# EasyEDA Pro project ProProject_校电赛c题第二版_2024-10-13.epro, board PCB3
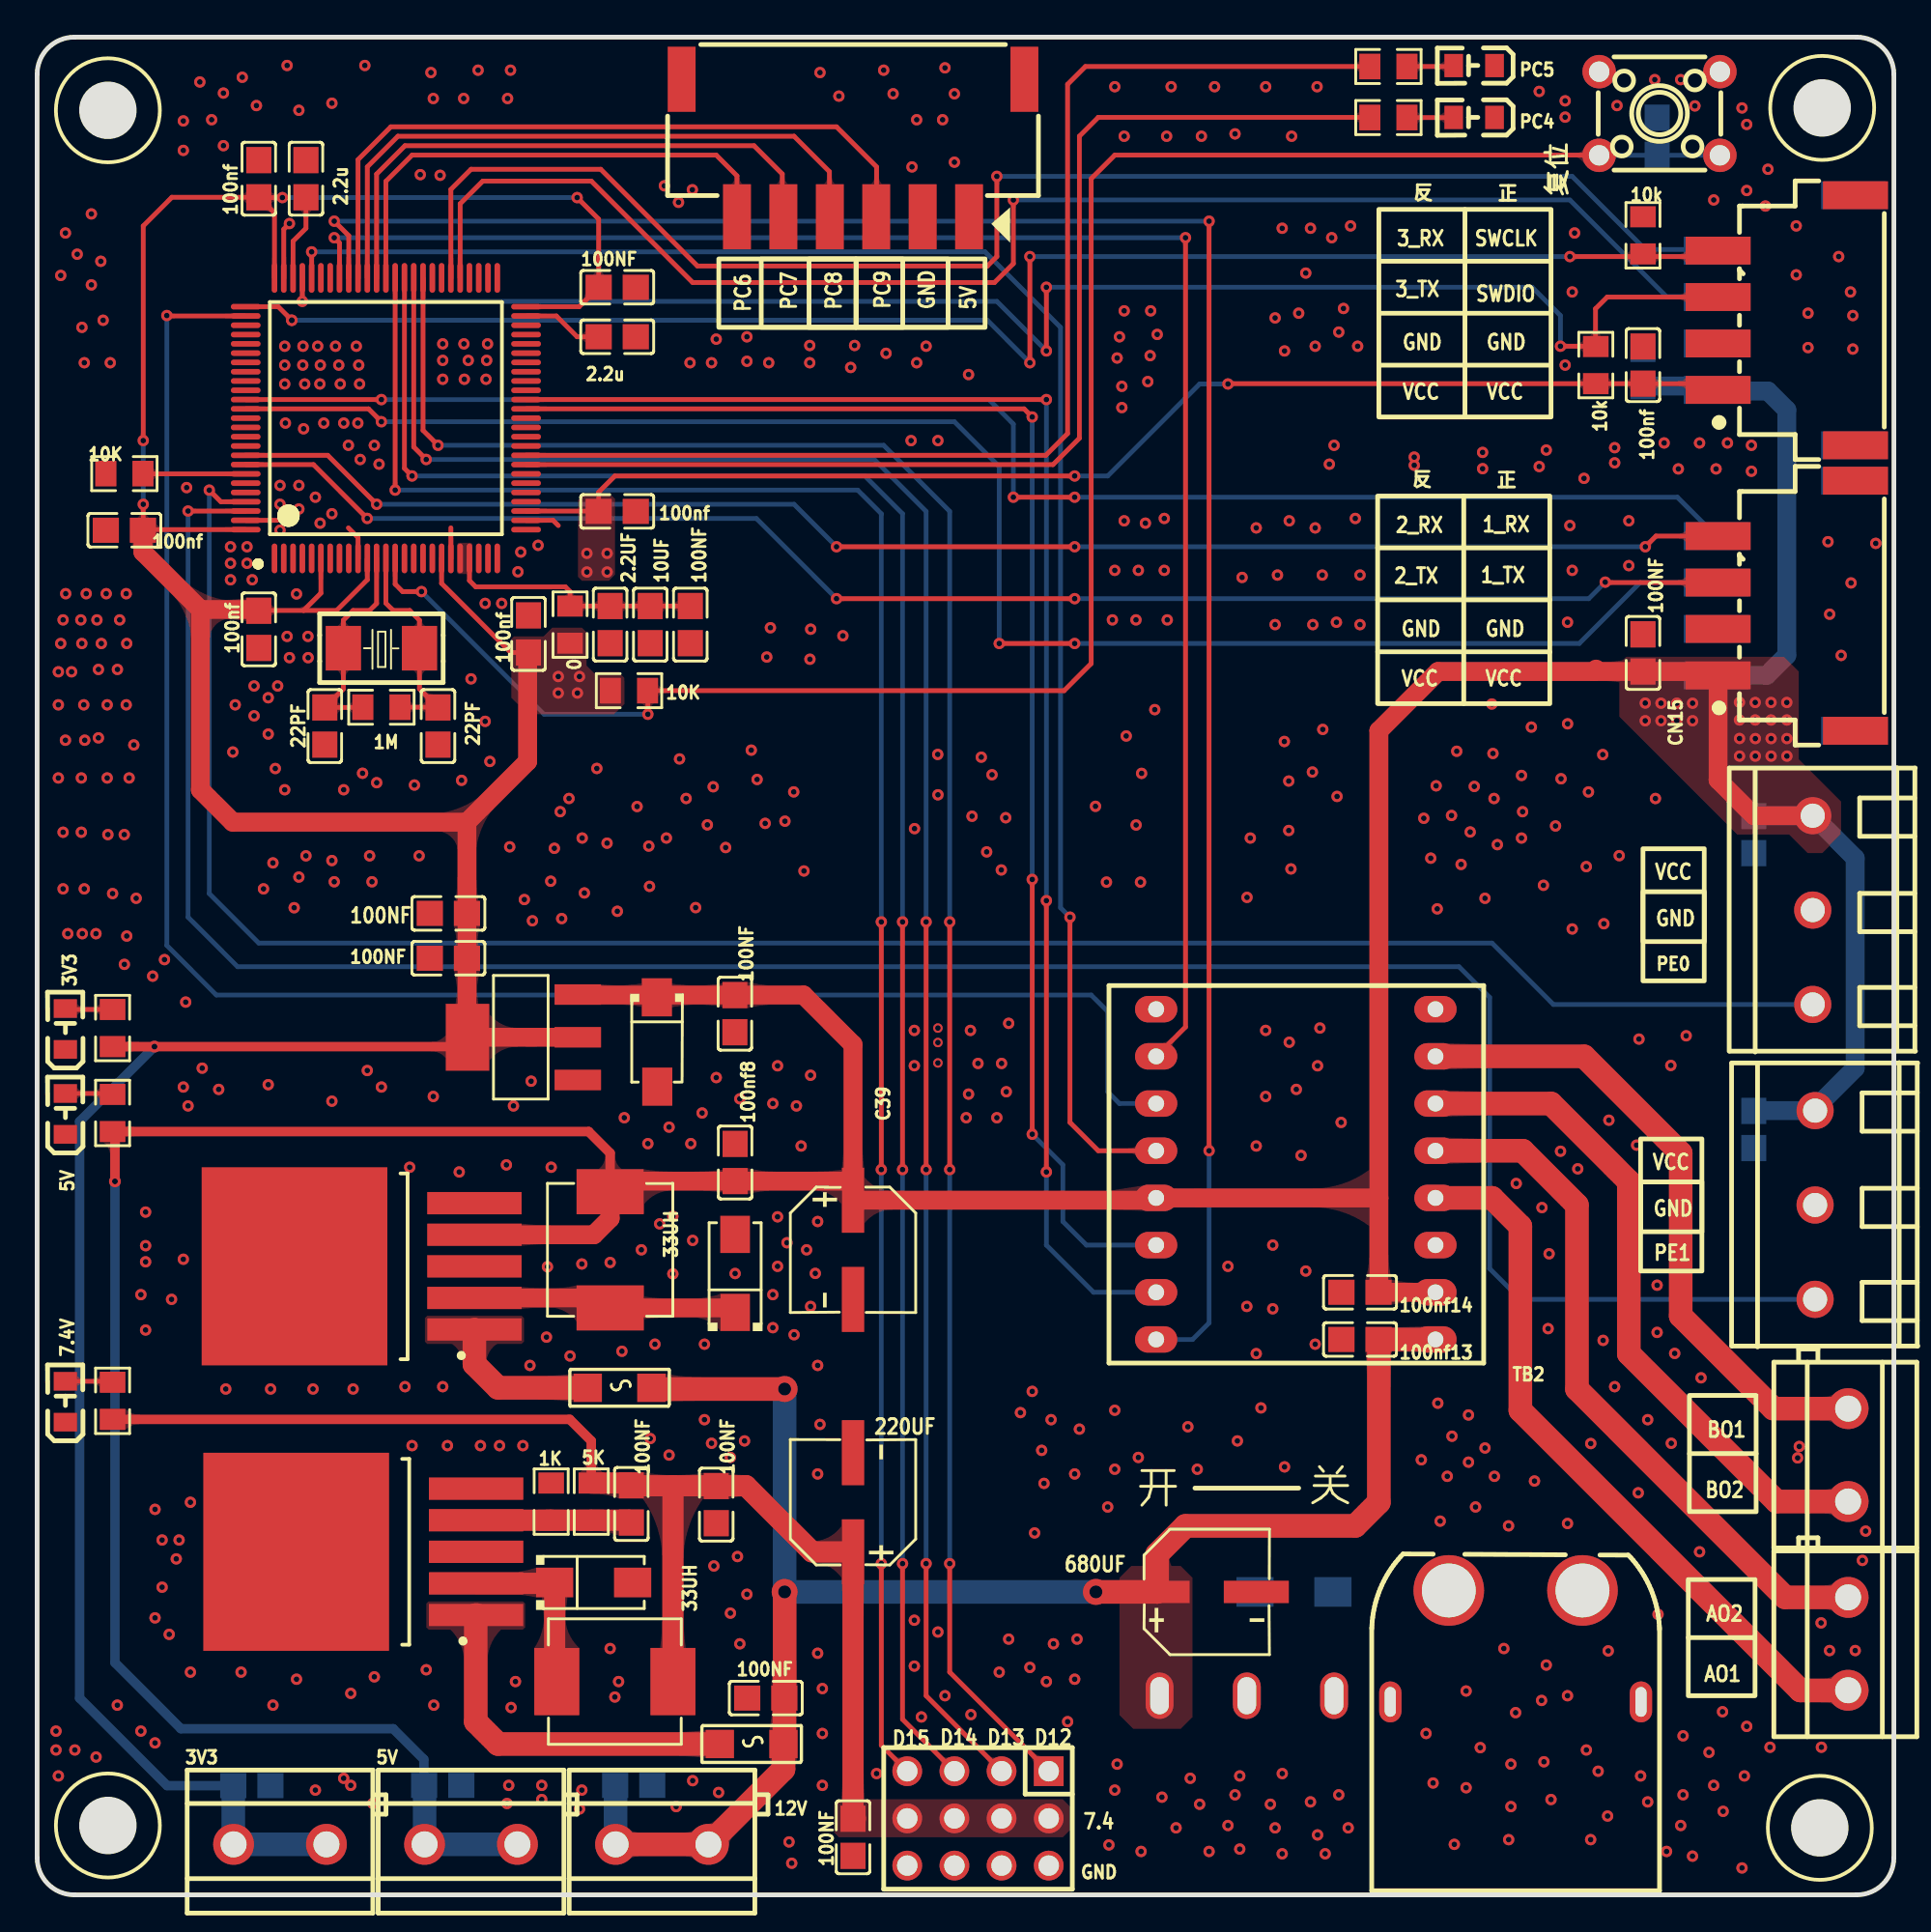
[diagram p2: board, top side]
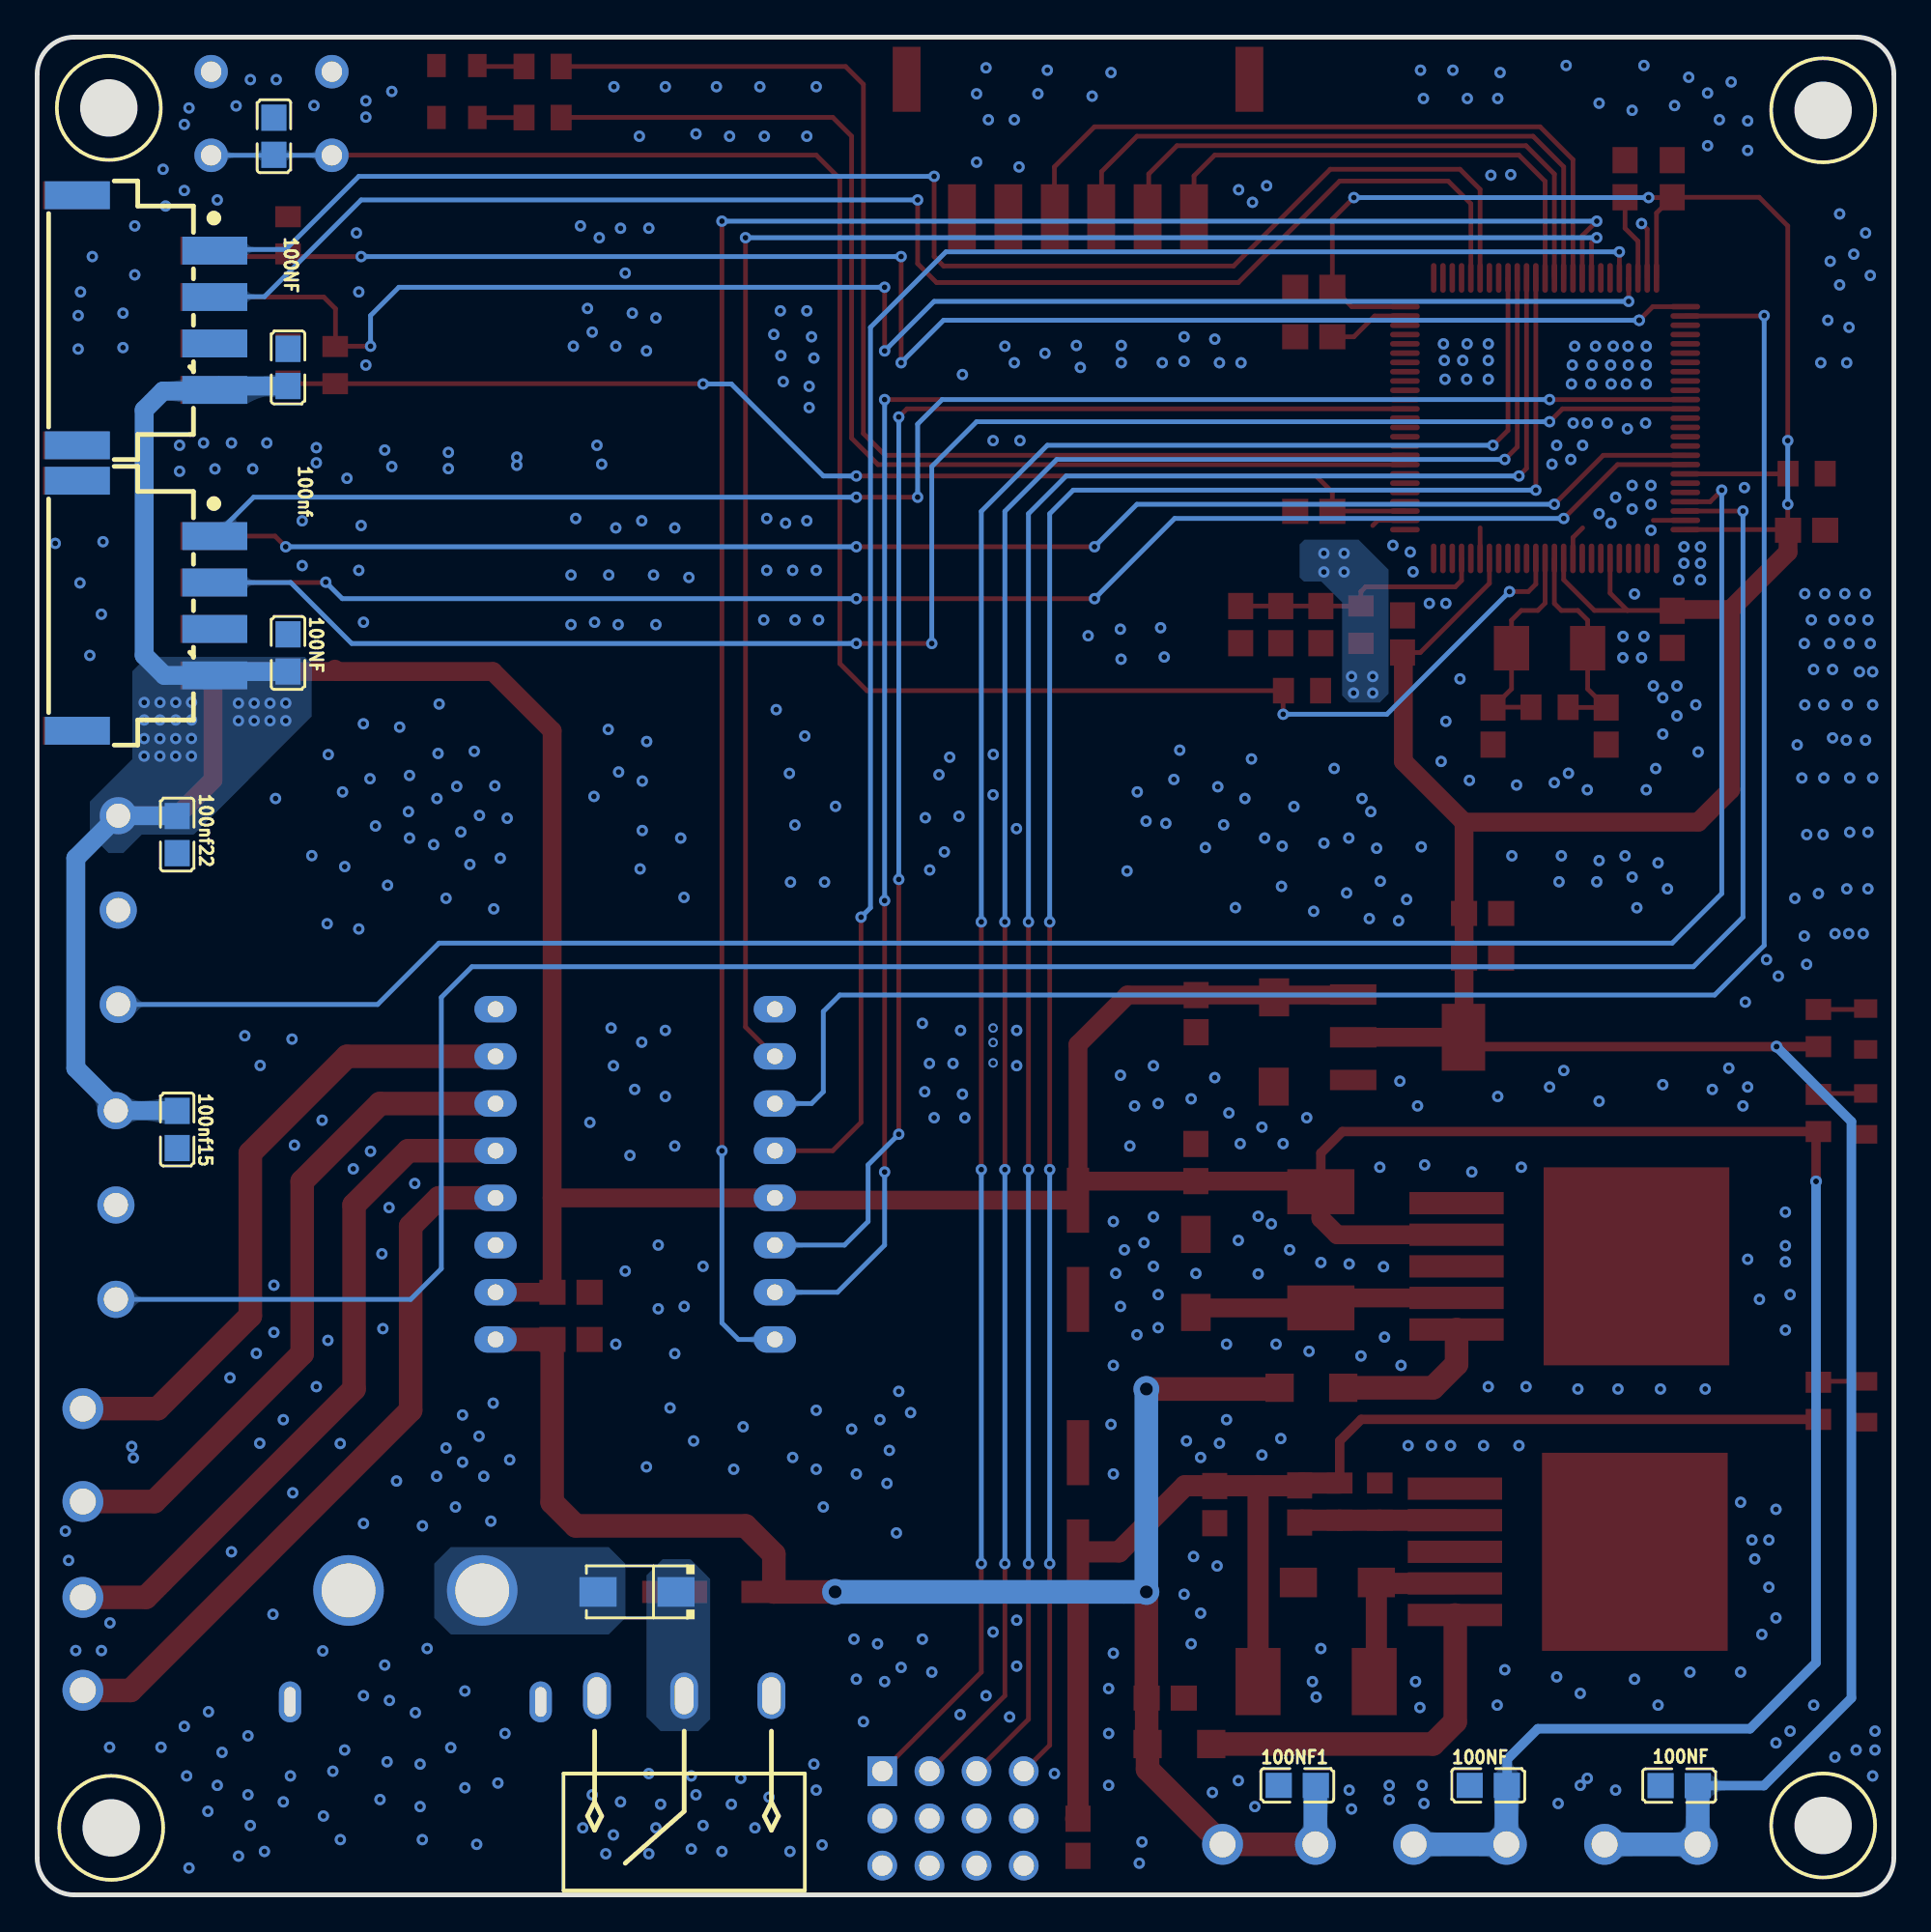
[diagram p3: board, bottom side, seen from below]

Outline 100 x 100 mm; copper layers: Top Layer, Bottom Layer. Coordinates in mm from the lower left corner of the outline.
Outline path: 0,98 0,2 arc(0.59,0.59) 2,0 98,0 arc(99.41,0.59) 100,2 100,98 arc(99.41,99.41) 98,100 2,100 arc(0.59,99.41) 0,98
Stack: Top Layer 0.035mm / Dielectric1 1.51mm FR4 er 4.5 / Bottom Layer 0.035mm

## Design rules (mm)
net OSC_OUT: DP1
net OSC_IN: DP1
template: JLCPCB Capability(Two Layers Board)
spacing copperThickness1oz (default): track to track 0.102, other pairs 0.152 to 0.3
spacing copperThickness2oz: track to track 0.203, other pairs 0.152 to 0.3
track width copperThickness1oz (default): min 0.127, default 0.254, max 2.54
track width copperThickness2oz: min 0.203, default 0.254, max 2.54
differential pair differentialPair (default): width min 0.127, default 0.254, max 2.54; gap min 0.152, default 0.152
via viaSize (default): diameter min 0.5, default 0.61, max 10; hole min 0.3, default 0.305, max 6.3

## Placement (name value [footprint] x y rotation side)
0  0  [R0805]  28.7 68.38 90 top
1K  1K  [R0805]  27.69 21.17 270 top
1M  1M  [R0805]  18.54 63.93 0 top
2  LM2596-5V  [lm2596]  20.48 33.2 180 top
2.2u  -  [C0805]  31.24 83.87 180 top
2.2u#2  -  [C0805]  14.48 92.38 270 top
2.2UF  2.2u  [C0805]  30.86 68.38 90 top
2K  -  [R0805]  72.78 98.42 0 top
2K1  2k  [R0805]  4.06 26.59 90 top
2K#2  -  [R0805]  72.78 95.67 0 top
3V3  -  [LED_0805]  1.52 46.66 90 top
3V3#2  -  [CONN-TH_P5.00_KF301-5.0-2P]  13.08 2.72 0 top
5  LM2596-ADJ  [lm2596-adj]  19.3 18.59 180 top
5K  -  [R0805]  4.06 42.09 90 top
5K#2  -  [R0805]  29.84 21.17 90 top
5V  -  [LED_0805]  1.52 42.09 90 top
5V#2  -  [CONN-TH_P5.00_KF301-5.0-2P]  23.37 2.72 0 top
7.4V  -  [LED_0805]  1.52 26.59 90 top
10K  -  [R0805]  31.88 64.82 0 top
10k  -  [R0805]  86.49 89.33 90 top
10k#2  -  [R0805]  83.95 82.35 270 top
10K#2  -  [R0805]  4.7 76.51 180 top
10UF  106  [C0805]  33.02 68.38 90 top
12V  KF301-5.0-2P  [CONN-TH_P5.00_KF301-5.0-2P]  33.65 2.72 0 top
22PF  -  [C0805]  21.59 62.92 90 top
22PF#2  -  [C0805]  15.49 62.92 90 top
33UH  -  [IND-SMD_L7.0-W6.6_FXL0630]  30.86 34.72 270 top
33UH#2  -  [IND-SMD_L7.0-W6.6_FXL0630]  31.11 11.48 180 top
100NF  -  [C0805]  37.58 47.43 90 top
100nf  -  [C0805]  31.24 74.47 180 top
100NF1  100nF  [C0805]  32.13 5.89 180 bottom
100nf8  100nF  [C0805]  37.59 39.42 270 top
100nf13  100nF  [C0805]  71.25 29.9 180 top
100nf14  100nF  [C0805]  71.25 32.44 180 top
100nf15  100nF  [C0805]  92.46 41.2 270 bottom
100nf22  100nF  [C0805]  92.46 57.07 90 bottom
100NF#2  -  [C0805]  22.15 50.42 0 top
100nf#2  -  [C0805]  11.94 68.12 270 top
100NF#3  -  [C0805]  86.49 66.85 270 top
100nf#3  -  [C0805]  26.46 67.87 90 top
100nf#4  -  [C0805]  4.7 73.46 180 top
100NF#4  -  [C0805]  31.24 86.54 0 top
100nf#5  -  [C0805]  11.94 92.38 90 top
100NF#5  -  [C0805]  35.18 68.38 90 top
100nf#6  -  [C0805]  86.49 82.35 90 top
100NF#6  -  [C0805]  39.24 10.59 0 top
100NF#7  -  [C0805]  32 21.04 90 top
100nf#7  -  [C0805]  86.49 82.22 90 bottom
100NF#8  -  [C0805]  36.58 21.01 90 top
100NF#9  -  [C0805]  43.94 3.1 90 top
100NF#10  -  [C0805]  11.56 5.88 180 bottom
100NF#11  -  [C0805]  21.84 5.89 180 bottom
100NF#12  -  [C0805]  86.49 66.85 270 bottom
100NF#13  -  [C0805]  87.25 94.67 90 bottom
677  STM32F407V  [lqfp-100_l14.0-w14.0-p0.50-ls16.0-bl]  18.78 79.49 0 top
C38  680UF  [CAP-SMD_BD6.3-L6.6-W6.6-FD]  62.99 16.31 0 top
C39  220UF  [CAP-SMD_BD6.3-L6.6-W6.6-FD]  43.94 34.72 270 top
C40  220UF  [CAP-SMD_BD6.3-L6.6-W6.6-FD]  43.94 21.13 90 top
CN4  WAFER-254W-4A  [CONN-SMD_4P-P2.50-WAFER-254W-4P]  94.23 84.76 90 top
CN15  WAFER-254W-4A  [CONN-SMD_4P-P2.50-WAFER-254W-4P]  94.23 69.39 90 top
CN16  XT60PW-M  [CONN-TH_XT60PW-M]  79.63 13.39 90 top
CN17  WAFER-254W-4A  [CONN-SMD_4P-P2.50-WAFER-254W-4P]  94.13 84.76 270 bottom
CN18  WAFER-254W-4A  [CONN-SMD_4P-P2.50-WAFER-254W-4P]  94.13 69.39 270 bottom
D1  SS54  [SMA_L4.3-W2.6-LS5.0-RD]  33.39 45.91 270 top
FU1  3A  [3a熔断器]  31.37 27.1 180 top
FU2  3A  [3a熔断器]  38.48 7.93 180 top
GND  01.5.5.1.304.03  [HDR-TH_12P-P2.54-V-M-R3-C4-S2.54]  50.67 4.12 180 top
NOREF  -  [C0805]  22.15 52.83 0 top
NOREF#2  -  [R0805]  4.06 46.66 90 top
P1  WJ500V-5.08-3P  [CONN-TH_3P-P5.00_WJ500V-5.08-3P]  95.76 37.14 90 top
PC4  -  [LED_0805]  77.34 95.68 180 top
PC5  -  [LED_0805]  77.34 98.48 180 top
PE0  WJ500V-5.08-3P  [CONN-TH_3P-P5.00_WJ500V-5.08-3P]  95.63 53.01 90 top
S1  单刀双掷  [弯]  65.15 3.23 90 bottom
SS1  SS34  [SMA_L4.3-W2.5-LS5.0-RD]  67.69 16.31 0 bottom
SS34  SS34  [SMA_L4.3-W2.5-LS5.0-RD]  37.59 33.45 90 top
ss34  SS34  [SMA_L4.3-W2.5-LS5.0-RD]  29.97 16.81 0 top
TB2  TB6612-MOD  [tb6612fng封装]  67.82 38.79 180 top
TP1  M3铜柱带丝印  [M3铜柱]  3.81 3.73 0 top
TP2  M3铜柱带丝印  [M3铜柱]  3.81 96.06 0 top
TP3  M3铜柱带丝印  [M3铜柱]  96.14 96.19 0 top
TP4  M3铜柱带丝印  [M3铜柱]  96.01 3.61 0 top
U5  AMS1117-3.3  [SOT-223-3_L6.5-W3.4-P2.30-LS7.0-BR]  26.15 46.16 0 top
U10  KF301-5.0-2P  [CONN-TH_P5.00_KF301-5.0-2P]  97.54 13.51 90 top
U11  KF301-5.0-2P  [CONN-TH_P5.00_KF301-5.0-2P]  97.54 23.67 90 top
X1  8MHz  [CRYSTAL-SMD_L5.0-W3.2]  18.54 67.11 0 top
复位  K2-1102DP-C4SW-04  [KEY-TH_4P-L6.0-W6.0-P4.50-LS6.5]  87.38 95.89 0 top
电机A1  BX-XH2.54-6PWT  [CONN-SMD_6P-P2.50_BX-XH2.54-6PWT]  43.94 94.03 180 top

## Footprints (pads in the part's own frame, mm; a bottom-side part is the same pattern mirrored in y, then rotated)
3a熔断器
  rect 1.524x1.524 smd: 1(-1.714,-0.194) 2(1.714,-0.194)
C0805
  rect 1.41x1.35 smd: 1(-1,0) 2(1,0)
CAP-SMD_BD6.3-L6.6-W6.6-FD
  rect 3.5x1.2 smd: 1(-2.67,0) 2(2.67,0)
CONN-SMD_4P-P2.50-WAFER-254W-4P
  rect 1.5x3.5 smd: 1(-3.75,3.7) 2(-1.25,3.7) 3(1.25,3.7) 4(3.75,3.7) 5(-6.73,-3.7) 6(6.73,-3.7)
CONN-SMD_6P-P2.50_BX-XH2.54-6PWT
  rect 1.5x3.5 smd: 1(-6.25,3.7) 2(-3.75,3.7) 3(-1.25,3.7) 4(1.25,3.7) 5(3.75,3.7) 6(6.25,3.7) 7(9.23,-3.7) 8(-9.23,-3.7)
CONN-TH_3P-P5.00_WJ500V-5.08-3P
  round 2 hole 1.3: 1(-5.08,0) 2(0,0) 3(5.08,0)
CONN-TH_P5.00_KF301-5.0-2P
  round 2.2 hole 1.4: 1(-2.5,0) 2(2.5,0)
CONN-TH_XT60PW-M
  round 3.8 hole 2.9: 1(3,-3.6) 2(3,3.6)
  oval 2.2x1.2 hole 1.6x0.6: 3(-3,6.75) 4(-3,-6.75)
CRYSTAL-SMD_L5.0-W3.2
  rect 1.9x2.4 smd: 1(-2.05,0) 2(2.05,0)
HDR-TH_12P-P2.54-V-M-R3-C4-S2.54
  rect 1.6x1.6 hole 1.1: 1(-3.81,-2.54)
  round 1.6 hole 1.1: 2(-3.81,0) 3(-3.81,2.54) 4(-1.27,-2.54) 5(-1.27,0) 6(-1.27,2.54) 7(1.27,-2.54) 8(1.27,0) 9(1.27,2.54) 10(3.81,-2.54) 11(3.81,0) 12(3.81,2.54)
IND-SMD_L7.0-W6.6_FXL0630
  rect 2.424x3.62 smd: 1(3.128,0) 2(-3.128,0)
KEY-TH_4P-L6.0-W6.0-P4.50-LS6.5
  round 1.8 hole 1.1: 1(-3.251,-2.251) 2(3.251,-2.251) 3(3.251,2.251) 4(-3.251,2.251)
LED_0805
  rect 1x1.25 smd: 1(-1.15,0.005) 2(1.05,0.005)
lm2596
  rect 5.08x1.2 smd: 1(-3.067,2.765) 2(-3.067,1.065) 3(-3.067,-0.635) 4(-3.067,-2.335) 5(-3.067,-4.035)
  rect 10x10.66 smd: 3(6.623,-0.635)
lm2596-adj
  rect 5.08x1.2 smd: 1(-4.337,3.527) 2(-4.337,1.827) 3(-4.337,0.127) 4(-4.337,-1.573) 5(-4.337,-3.273)
  rect 10x10.66 smd: 3(5.353,0.127)
lqfp-100_l14.0-w14.0-p0.50-ls16.0-bl
  oval 0.3x1.6 smd: 1(-6,-7.55) 2(-5.5,-7.55) 3(-5,-7.55) 4(-4.5,-7.55) 5(-4,-7.55) 6(-3.5,-7.55) 7(-3,-7.55) 8(-2.5,-7.55) 9(-2,-7.55) 10(-1.5,-7.55) 11(-1,-7.55) 12(-0.5,-7.55) 13(0,-7.55) 14(0.5,-7.55) 15(1,-7.55) 16(1.5,-7.55) 17(2,-7.55) 18(2.5,-7.55) 19(3,-7.55) 20(3.5,-7.55) 21(4,-7.55) 22(4.5,-7.55) 23(5,-7.55) 24(5.5,-7.55) 25(6,-7.55) 51(6,7.55) 52(5.5,7.55) 53(5,7.55) 54(4.5,7.55) 55(4,7.55) 56(3.5,7.55) 57(3,7.55) 58(2.5,7.55) 59(2,7.55) 60(1.5,7.55) 61(1,7.55) 62(0.5,7.55) 63(0,7.55) 64(-0.5,7.55) 65(-1,7.55) 66(-1.5,7.55) 67(-2,7.55) 68(-2.5,7.55) 69(-3,7.55) 70(-3.5,7.55) 71(-4,7.55) 72(-4.5,7.55) 73(-5,7.55) 74(-5.5,7.55) 75(-6,7.55)
  oval 1.6x0.3 smd: 26(7.55,-6) 27(7.55,-5.5) 28(7.55,-5) 29(7.55,-4.5) 30(7.55,-4) 31(7.55,-3.5) 32(7.55,-3) 33(7.55,-2.5) 34(7.55,-2) 35(7.55,-1.5) 36(7.55,-1) 37(7.55,-0.5) 38(7.55,0) 39(7.55,0.5) 40(7.55,1) 41(7.55,1.5) 42(7.55,2) 43(7.55,2.5) 44(7.55,3) 45(7.55,3.5) 46(7.55,4) 47(7.55,4.5) 48(7.55,5) 49(7.55,5.5) 50(7.55,6) 76(-7.55,6) 77(-7.55,5.5) 78(-7.55,5) 79(-7.55,4.5) 80(-7.55,4) 81(-7.55,3.5) 82(-7.55,3) 83(-7.55,2.5) 84(-7.55,2) 85(-7.55,1.5) 86(-7.55,1) 87(-7.55,0.5) 88(-7.55,0) 89(-7.55,-0.5) 90(-7.55,-1) 91(-7.55,-1.5) 92(-7.55,-2) 93(-7.55,-2.5) 94(-7.55,-3) 95(-7.55,-3.5) 96(-7.55,-4) 97(-7.55,-4.5) 98(-7.55,-5) 99(-7.55,-5.5) 100(-7.55,-6)
R0805
  rect 1.133x1.377 smd: 1(-1,0) 2(1,0)
SMA_L4.3-W2.5-LS5.0-RD
  rect 2x1.593 smd: 1(-2.1,0) 2(2.1,0)
SMA_L4.3-W2.6-LS5.0-RD
  rect 2.047x1.621 smd: 1(-2.403,-0.01) 2(2.403,0.01)
SOT-223-3_L6.5-W3.4-P2.30-LS7.0-BR
  rect 2.5x1.1 smd: 1(2.97,-2.3) 2(2.97,0) 3(2.97,2.3)
  rect 2.34x3.6 smd: 4(-2.97,0)
tb6612fng封装
  oval 2.276x1.423 hole 0.855x0.85: 1(-7.493,8.89) 2(-7.493,6.35) 3(-7.493,3.81) 4(-7.493,1.27) 5(-7.493,-1.27) 6(-7.493,-3.81) 7(-7.493,-6.35) 8(-7.493,-8.89) 9(7.55,-8.89) 10(7.55,-6.35) 11(7.55,-3.81) 12(7.55,-1.27) 13(7.55,1.27) 14(7.55,3.81) 15(7.55,6.35) 16(7.55,8.89)
弯
  rrect 2.5x1.5 hole 2x1: 1(7.493,4.699) 2(7.493,0) 3(7.493,-4.699)

## Nets
+5V: 电机A1.1
GND: 1K.1 2.3 2.5 2.2u.1 2.2u#2.1 2.2UF.1 3V3.1 5.3 5.5 5V.1 7.4V.1 10k.2 10K#2.2 10UF.1 22PF.1 22PF#2.1 100NF.1 100nf.1 100NF1.1 100nf8.1 100nf13.2 100nf14.2 100nf15.2 100nf22.1 100NF#2.1 100nf#2.2 100NF#3.1 100nf#3.2 100nf#4.2 100NF#4.2 100NF#5.1 100nf#5.2 100NF#6.1 100nf#6.2 100nf#7.2 100NF#8.1 100NF#9.1 100NF#10.1 100NF#11.1 100NF#12.1 100NF#13.2 677.10 677.20 677.27 677.74 677.99 C38.2 C39.2 C40.2 CN4.2 CN15.2 CN16.1 CN16.3 CN16.4 CN17.3 CN18.3 D1.2 GND.3 GND.6 GND.9 GND.12 NOREF.1 P1.2 PC4.1 PC5.1 PE0.2 SS34.2 ss34.2 TB2.3 TB2.8 TB2.9 U5.1 复位.3 复位.4 电机A1.2
VCC3V: 0.1 3V3#2.1 3V3#2.2 10K.1 10k#2.2 100nf.2 100nf#2.1 100NF#2.2 100nf#3.1 100nf#4.1 100NF#4.1 100nf#5.1 100nf#6.1 100NF#10.2 677.6 677.11 677.19 677.28 677.50 677.75 677.100 CN4.1 NOREF.2 NOREF#2.1 U5.2 U5.4
VCC5V: 2.4 5K.1 5V#2.1 5V#2.2 33UH.2 100NF.2 100nf8.2 100nf14.1 100nf15.1 100nf22.2 100NF#3.2 100nf#7.1 100NF#11.2 100NF#12.2 C39.1 CN15.1 CN17.4 CN18.4 D1.1 P1.3 PE0.3 TB2.2 TB2.13 U5.3
VCC7.4V: 2K1.1 5K#2.2 33UH#2.2 100NF#7.2 100NF#8.2 100NF#9.2 C40.1 GND.2 GND.5 GND.8 GND.11
VCC12V: 12V.1 12V.2 100NF1.2 100nf13.1 100NF#6.2 C38.1 FU1.1 FU2.1 S1.3 TB2.1
AIN1: 677.39 TB2.14
AIN2: 677.40 TB2.15
AO1: TB2.4 U10.1
AO2: TB2.5 U10.2
BIN1: 677.71 TB2.12
BIN2: 677.77 TB2.11
BO1: TB2.7 U11.2
BO2: TB2.6 U11.1
LED2_PC4: 2K#2.1 677.33
LED3_PC5: 2K.1 677.34
OSC_IN: 1M.1 22PF#2.2 677.12 X1.1
OSC_OUT: 1M.2 22PF.2 677.13 X1.2
PC6: 677.63 电机A1.6
PC7: 677.64 电机A1.5
PC8: 677.65 电机A1.4
PC9: 677.66 电机A1.3
PE0: 677.97 PE0.1
PE1: 677.98 P1.1
PE2: 677.1
POWER12V: S1.2 SS1.1
PWMA: 677.67 TB2.16
PWMB: 677.68 TB2.10
RESET: 10K.2 100NF#13.1 677.14 复位.1 复位.2
STEER1: 677.59 GND.1
STEER2: 677.60 GND.4
STEER3: 677.61 GND.7
STEER4: 677.62 GND.10
SWCLK: 10k.1 677.76 CN4.4
SWDIO: 10k#2.1 677.72 CN4.3
USART1_RX: 677.93 CN15.3
USART1_TX: 677.92 CN15.4
USART2_RX: 677.87 CN18.2
USART2_TX: 677.86 CN18.1
USART3_RX: 677.56 CN17.1
USART3_TX: 677.55 CN17.2
$1N4136: 677.5
$1N4138: 677.4
$1N4142: 677.2
$1N4150: 677.54
$1N4152: 677.53
$1N4154: 677.52
$1N4156: 677.51
$1N4158: 677.48
$1N4160: 677.47
$1N4162: 677.96
$1N4164: 677.95
$1N4170: 677.91
$1N4172: 677.90
$1N4174: 677.89
$1N4178: 677.36
$1N4180: 677.35
$1N4186: 677.70
$1N4188: 677.69
$1N4194: 677.32
$1N4196: 677.31
$1N4198: 677.30
$1N4200: 677.29
$1N4202: 677.26
$1N4204: 677.25
$1N4206: 677.24
$1N4208: 677.23
$1N4210: 677.46
$1N4212: 677.45
$1N4214: 677.44
$1N4216: 677.43
$1N4222: 677.7
$1N4224: 677.80
$1N4226: 677.79
$1N4228: 677.78
$1N4242: 677.17
$1N4244: 677.16
$1N4246: 677.15
$1N4256: 677.58
$1N4258: 677.57
$1N4264: 677.88
$1N4270: 677.85
$1N4272: 677.83
$1N4274: 677.82
$1N4276: 677.81
$1N4303: 5K.2 5V.2
$1N4305: 3V3.2 NOREF#2.2
$1N4501: 2K.2 PC5.2
$1N4502: 2K#2.2 PC4.2
$1N4519: 677.41
$1N4521: 677.42
$1N4523: 677.18
$1N4552: 0.2 2.2UF.2 10UF.2 100NF#5.2 677.21 677.22
$1N4554: 2.2u#2.2 677.73
$1N4555: 2.2u.2 677.49
$1N11019: 10K#2.1 677.94
$1N11427: 677.38
$1N28449: 2.1 FU1.2
$1N28458: 2.2 33UH.1 SS34.1
$1N28460: 5.1 FU2.2
$1N28462: 1K.2 5.4 5K#2.1 100NF#7.1
$1N28463: 5.2 33UH#2.1 ss34.1
$1N28468: CN16.2 SS1.2
$1N28554: 2K1.2 7.4V.2

Pads without a net: 677 3 8 9 37 84; CN4 5 6; CN15 5 6; CN17 5 6; CN18 5 6; S1 1; 电机A1 7 8

## Via types
v1: diameter 0.61, hole 0.305, Top Layer to Bottom Layer, 771 vias
v2: diameter 0.508, hole 0.305, Top Layer to Bottom Layer, 3 vias
v3: diameter 0.635, hole 0.318, Top Layer to Bottom Layer, 2 vias
v4: diameter 1.397, hole 0.699, Top Layer to Bottom Layer, 3 vias

## Routing (per net, layer and track width the routed paths; a pad name or vN(x,y) marks a point on that pad's centre or on a via; arc(x,y) is an arc through that point)
GND: length 10.1
  Top Layer w0.254: 28.07,73.71 27.79,73.99 677.27 ; v1(13.59,89.97) 13.28,89.66 677.74 ; 677.99 12.95,73.99 ; 16.76,73.58 17.28,73.06 677.10 ; 677.20 22.28,73.58
  vias: v1(1.02,8.81) v1(1.02,7.8) v1(1.14,65.84) v1(1.14,64.06) v1(1.14,60.12) v1(1.14,6.4) v1(1.27,87.17) v1(1.27,67.36) v1(1.4,68.63) v1(1.4,57.2) v1(1.4,54.15) v1(1.52,89.46) v1(1.54,70.04) v1(1.52,62.15) v1(1.65,51.74) v1(1.85,65.84) v1(2.03,7.8) v1(2.16,88.32) v1(2.35,68.63) v1(2.41,84.38) v1(2.41,67.36) v1(2.38,60.12) v1(2.38,57.2) v1(2.43,51.74) v1(2.54,82.47) v1(2.51,64.06) v1(2.56,62.15) v1(2.54,54.15) v1(2.64,70.04) v1(2.92,90.48) v1(2.92,86.67) v1(3.17,51.74) v1(3.17,7.42) v1(3.22,68.63) v1(3.3,65.96) v1(3.3,62.28) v1(3.43,87.94) v1(3.46,67.36) v1(3.56,84.76) v1(3.72,70.04) v1(3.77,64.06) v1(3.77,60.12) v1(3.81,57.07) v1(3.94,82.47) v1(4.06,53.9) v1(4.33,65.96) v1(4.32,10.21) v1(4.44,68.63) v1(4.69,57.07) v1(4.7,50.09) v1(4.8,70.04) v1(4.82,67.36) v1(4.8,64.06) v1(4.83,51.61) v1(4.96,60.12) v1(5.21,61.9) v1(5.33,53.65) v1(5.59,32.31) v1(5.59,8.81) v1(5.84,36.75) v1(5.84,34.94) v1(5.84,34.08) v1(5.84,30.4) v1(6.22,49.45) v1(6.35,20.75) v1(6.35,14.91) v1(6.35,8.18) v1(6.73,19.1) v1(6.73,16.56) v1(6.86,50.34) v1(7.11,14.02) v1(7.24,32.06) v1(7.49,18.09) v1(7.64,19.1) v1(7.87,95.49) v1(7.87,93.9) v1(7.87,43.48) v1(7.87,34.21) v1(8.05,75.75) v1(8,48.06) v1(8.13,42.47) v1(8.25,21.13) v1(8.25,11.99) v1(8.76,97.59) v1(8.89,44.5) v1(9.4,95.56) v1(9.78,43.36) v1(10.03,96.99) v1(10.03,94.16) v1(10.16,27.23) v1(10.41,72.57) v1(10.41,71.68) v1(10.41,70.79) v1(10.54,61.52) v1(10.67,64.06) v1(11.05,97.84) v1(10.98,11.99) v1(11.3,72.57) v1(11.3,71.68) v1(11.58,70.79) v1(11.68,65.08) v1(11.68,63.47) v1(11.81,96.32) v1(12.19,54.15) v1(12.45,64.44) v1(12.45,62.49) v1(12.45,43.61) v1(12.57,27.23) v1(12.7,55.55) v1(12.7,10.21) v1(12.83,60.63) v1(12.95,65.08) v1(13.08,75.87) v1(13.08,74.85) v1(13.08,73.46) v1(13.33,83.36) v1(13.33,82.35) v1(13.33,81.33) v1(13.37,79.23) v1(13.33,59.49) v1(13.46,98.48) v1(13.46,67.74) v1(13.59,66.6) v1(13.84,53.14) v1(13.97,70.03) v1(13.97,11.61) v1(14.1,96.06) v1(14.1,75.87) v1(14.1,74.6) v1(14.1,54.79) v1(14.32,83.36) v1(14.31,82.35) v1(14.35,78.92) v1(14.41,81.33) v1(14.48,55.93) v1(14.58,67.74) v1(14.6,66.6) v1(14.86,27.23) v1(14.99,75.23) v1(14.99,5.64) v1(15.11,83.36) v1(15.25,82.35) v1(15.23,81.33) v1(15.24,73.84) v1(15.44,79.23) v1(15.88,96.44) v1(15.88,74.35) v1(15.88,55.68) v1(15.88,42.72) v1(16.07,83.36) v1(16,54.53) v1(16.25,82.35) v1(16.33,81.33) v1(16.51,79.23) v1(16.51,59.49) v1(16.51,6.27) v1(16.76,78.03) v1(16.89,10.85) v1(16.89,5.89) v1(17.02,27.23) v1(17.19,83.36) v1(17.27,79.23) v1(17.32,82.35) v1(17.37,81.33) v1(17.4,77.27) v1(17.53,60.38) v1(17.65,98.48) v1(17.78,44.37) v1(17.91,55.93) v1(18.03,54.53) v1(18.16,78.03) v1(18.16,11.74) v1(18.08,4.92) v1(18.29,59.87) v1(18.41,77.01) v1(18.54,43.48) v1(19.81,27.36) v1(20.07,39.17) v1(20.19,24.18) v1(20.32,59.74) v1(20.57,55.93) v1(20.63,92.6) v1(20.95,12.12) v1(21.21,98.09) v1(21.34,96.7) v1(21.34,42.98) v1(21.36,10.21) v1(21.7,92.56) v1(21.84,83.49) v1(21.84,82.6) v1(21.84,81.59) v1(21.84,27.36) v1(22.1,24.18) v1(22.73,38.91) v1(22.86,60) v1(22.97,96.7) v1(22.98,83.49) v1(23.01,81.59) v1(23.22,82.6) v1(23.37,65.46) v1(23.75,98.22) v1(23.88,24.18) v1(24.13,69.52) v1(24.13,63.17) v1(24.26,83.49) v1(24.21,82.6) v1(24.18,81.59) v1(24.38,61.01) v1(24.9,24.18) v1(25.02,69.52) v1(25.27,39.29) v1(25.34,96.7) v1(25.31,4.92) v1(25.45,56.42) v1(25.4,5.89) v1(25.49,98.22) v1(25.53,10.08) v1(25.65,42.47) v1(25.76,11.48) v1(25.89,71.22) v1(26.05,72.28) v1(26.16,24.18) v1(26.24,53.58) v1(26.54,28.5) v1(26.67,52.43) v1(26.61,43.8) v1(26.98,72.65) v1(27.18,5.89) v1(27.18,5.13) v1(27.43,30.02) v1(27.48,33.81) v1(27.66,54.56) v1(27.69,39.17) v1(27.86,56.34) v1(28.17,58.31) v1(28.25,52.55) v1(28.65,59.02) v1(28.7,29.01) v1(29.21,4.62) v1(29.35,56.89) v1(29.34,33.96) v1(29.34,5.64) v1(29.47,53.93) v1(30.14,60.63) v1(30.7,56.61) v1(30.86,34.04) v1(30.86,13.26) v1(31.11,10.65) v1(31.25,52.95) v1(31.32,11.48) v1(31.5,29.26) v1(31.62,41.83) v1(32.31,58.58) v1(32.54,34.72) v1(32.94,56.45) v1(32.89,40.44) v1(32.98,54.29) v1(33.02,24.56) v1(33.27,29.64) v1(33.53,36.12) v1(33.78,92) v1(33.89,56.89) v1(34.04,41.33) v1(34.04,23.67) v1(34.24,36.53) v1(34.24,33.43) v1(34.42,4.75) v1(34.54,91.11) v1(34.6,61.15) v1(34.95,59.02) v1(35.16,82.47) v1(35.21,40.44) v1(35.29,91.79) v1(35.31,35.23) v1(35.31,6.15) v1(35.47,53.14) v1(35.81,42.09) v1(35.94,29.64) v1(35.94,25.58) v1(36.1,57.6) v1(36.32,82.47) v1(36.32,24.31) v1(36.41,59.65) v1(36.45,17.7) v1(36.58,83.74) v1(36.58,43.99) v1(36.7,5.51) v1(37.08,56.38) v1(37.34,23.55) v1(37.34,15.16) v1(37.59,33.45) v1(37.72,18.21) v1(37.85,42.85) v1(37.85,13.51) v1(38.1,24.44) v1(38.23,83.87) v1(38.23,82.55) v1(38.23,16.18) v1(38.46,61.62) v1(38.78,60.04) v1(39.21,57.68) v1(39.3,66.63) v1(39.4,82.47) v1(39.49,68.21) v1(39.62,42.6) v1(39.62,32.31) v1(39.62,30.53) v1(39.88,44.63) v1(39.88,36.5) v1(39.88,33.83) v1(40.28,57.8) v1(40.39,35.1) v1(40.5,2.85) v1(40.64,1.7) v1(40.75,59.37) v1(40.77,30.15) v1(40.89,42.47) v1(41.15,40.31) v1(41.3,55.12) v1(41.44,34.72) v1(41.61,83.4) v1(41.61,82.47) v1(41.66,68.13) v1(41.62,66.51) v1(41.66,44.12) v1(41.66,31.67) v1(41.91,33.45) v1(42.04,36.25) v1(42.04,28.5) v1(42.04,22.66) v1(42.04,13) v1(42.16,98.09) v1(42.16,25.32) v1(42.29,11.1) v1(42.29,8.69) v1(42.29,5.89) v1(43.18,96.83) v1(43.4,67.78) v1(43.81,82.22) v1(44.03,83.4) v1(45.21,6.53) v1(45.59,98.22) v1(45.72,82.98) v1(46.1,96.95) v1(47.07,78.28) v1(47.12,93.02) v1(47.25,57.39) v1(47.24,46.53) v1(47.24,44.63) v1(47.24,14.78) v1(47.24,12.31) v1(47.37,95.56) v1(47.37,82.47) v1(47.62,9.58) v1(47.88,83.36) v1(48.51,78.28) v1(48.5,61.39) v1(48.52,59.22) v1(48.51,14.15) v1(48.77,95.56) v1(48.89,98.35) v1(48.89,10.72) v1(49.4,96.95) v1(49.4,93.27) v1(50.04,41.83) v1(50.17,81.84) v1(50.17,43.1) v1(50.27,46.53) v1(50.35,58.06) v1(50.29,9.7) v1(50.67,44.76) v1(50.85,61.24) v1(51.14,56.14) v1(51.43,60.3) v1(51.69,41.83) v1(51.82,11.99) v1(51.93,55.17) v1(51.94,44.76) v1(52.17,57.98) v1(52.2,43.23) v1(52.32,46.91) v1(52.32,13.77) v1(52.96,25.96) v1(53.47,12.24) v1(53.59,27.1) v1(53.72,19.48) v1(54.1,23.93) v1(54.23,22.15) v1(54.36,11.48) v1(54.61,25.58) v1(54.74,13.51) v1(55.5,9.32) v1(55.88,22.66) v1(55.88,11.61) v1(56.01,13.77) v1(56.13,25.07) v1(57,58.6) v1(57.59,54.52) v1(57.66,20.88) v1(57.72,2.69) v1(57.91,68.63) v1(58.04,97.33) v1(58.04,71.3) v1(58.04,26.09) v1(58.04,22.91) v1(58.04,5.64) v1(58.17,82.73) v1(58.17,7.04) v1(58.29,83.87) v1(58.42,81.2) v1(58.42,80.06) v1(58.55,94.67) v1(58.55,85.27) v1(58.55,73.97) v1(58.66,62.38) v1(59.18,68.63) v1(59.19,57.59) v1(59.31,71.3) v1(59.31,23.55) v1(59.43,54.52) v1(59.46,2.34) v1(59.48,60.37) v1(59.69,73.84) v1(59.82,81.46) v1(59.97,85.27) v1(59.94,82.86) v1(60.19,63.8) v1(60.33,84) v1(60.58,5.26) v1(60.71,74.09) v1(60.71,71.3) v1(60.83,94.67) v1(60.87,68.63) v1(61.08,97.33) v1(61.34,3.61) v1(61.98,25.2) v1(62.1,6.27) v1(62.48,22.91) v1(62.61,4.88) v1(62.71,94.67) v1(63.12,2.34) v1(63.42,97.33) v1(64.14,33.83) v1(64.14,3.73) v1(64.52,94.79) v1(64.52,5.38) v1(64.64,24.44) v1(64.77,6.4) v1(64.77,2.46) v1(64.9,70.92) v1(65.16,53.69) v1(65.15,31.67) v1(65.34,56.89) v1(65.66,73.58) v1(65.66,40.31) v1(65.66,29.13) v1(65.91,26.21) v1(66.17,97.33) v1(66.17,46.53) v1(66.17,42.98) v1(66.42,4.88) v1(66.55,34.98) v1(66.55,31.55) v1(66.67,84.89) v1(66.67,68.38) v1(66.67,3.61) v1(66.8,71.04) v1(67.06,89.71) v1(67.06,6.53) v1(67.06,2.21) v1(67.17,62.08) v1(67.18,83.11) v1(67.18,23.04) v1(67.44,73.97) v1(67.41,59.96) v1(67.41,57.29) v1(67.44,45.9) v1(67.56,94.67) v1(67.53,55.23) v1(67.82,43.36) v1(67.95,85.14) v1(68.07,39.8) v1(68.33,87.3) v1(68.33,33.58) v1(68.58,89.71) v1(68.58,5) v1(68.71,68.38) v1(68.68,60.44) v1(68.83,83.36) v1(68.83,73.58) v1(68.83,29.64) v1(68.93,97.33) v1(68.96,44.63) v1(68.96,3.23) v1(69.09,46.66) v1(69.21,71.04) v1(69.24,62.73) v1(69.37,2.21) v1(69.6,77.01) v1(69.72,89.2) v1(69.85,78.03) v1(69.98,68.5) v1(70.01,59.13) v1(70.1,84.12) v1(70.1,5.38) v1(70.23,41.58) v1(70.36,85.4) v1(70.61,3.61) v1(70.74,89.84) v1(70.99,74.09) v1(71.12,83.36) v1(71.25,71.04) v1(71.25,68.38) v1(74.17,77.39) v1(74.17,76.96) v1(74.55,23.42) v1(74.68,57.95) v1(74.8,8.69) v1(75.06,55.8) v1(75.18,6.02) v1(75.35,59.7) v1(75.41,53.08) v1(75.44,26.47) v1(75.56,20.12) v1(75.95,22.53) v1(76.18,58.1) v1(76.2,24.69) v1(76.33,2.72) v1(76.46,61.56) v1(76.69,55.47) v1(76.96,10.97) v1(76.96,5.77) v1(77.09,25.83) v1(77.09,23.29) v1(77.18,57.22) v1(77.4,59.67) v1(77.47,20.88) v1(77.72,7.93) v1(77.85,77.65) v1(77.85,76.77) v1(77.98,53.65) v1(77.98,24.05) v1(78.35,64.1) v1(78.41,61.44) v1(78.47,59.02) v1(78.49,22.53) v1(78.64,56.53) v1(78.99,13.26) v1(79.25,19.86) v1(79.25,2.97) v1(79.37,7.04) v1(79.37,4.75) v1(79.66,38.29) v1(79.63,9.81) v1(79.95,60.26) v1(79.95,56.89) v1(80,58.31) v1(80.48,62.86) v1(80.64,22.28) v1(80.9,97.08) v1(80.9,76.89) v1(81.05,37) v1(81.03,10.47) v1(81.13,54.34) v1(81.15,7.16) v1(81.28,77.78) v1(81.28,12.37) v1(81.43,34.51) v1(81.38,30.48) v1(81.53,5.13) v1(81.78,57.54) v1(82.07,60.08) v1(82.05,40.03) v1(82.3,96.57) v1(82.3,95.69) v1(82.3,82.35) v1(82.42,68.5) v1(82.43,63.04) v1(82.42,19.99) v1(82.42,10.72) v1(82.55,73.71) v1(82.68,86.28) v1(82.68,71.3) v1(82.68,51.99) v1(82.8,89.46) v1(82.97,39.08) v1(83.31,76.25) v1(83.43,55.35) v1(83.44,7.8) v1(83.55,59.37) v1(83.67,24.29) v1(83.67,2.97) v1(84.07,6.66) v1(84.32,61.38) v1(84.34,29.85) v1(84.38,52.28) v1(84.65,41.7) v1(84.62,13.13) v1(84.58,4.24) v1(84.96,77.9) v1(84.96,77.09) v1(84.96,27.36) v1(85.09,96.32) v1(85.21,55.94) v1(85.73,73.97) v1(85.73,71.55) v1(86.14,40.36) v1(86.27,46.07) v1(86.23,21.64) v1(86.36,6.4) v1(86.74,25.58) v1(86.74,5) v1(87.12,97.71) v1(87.16,59.02) v1(87.25,32.82) v1(87.25,30.28) v1(87.3,15.1) v1(87.63,78.16) v1(87.76,2.34) v1(87.99,44.65) v1(88.01,24.31) v1(88.2,29.15) v1(88.39,76.76) v1(88.52,97.71) v1(88.52,3.73) v1(88.65,8.56) v1(88.65,5.38) v1(88.81,46.24) v1(89.15,2.08) v1(89.28,96.3) v1(89.53,78.16) v1(89.53,18.47) v1(89.61,27.83) v1(90.04,7.67) v1(90.3,91.24) v1(90.3,5.89) v1(90.42,76.76) v1(90.77,9.86) v1(90.8,4.5) v1(91.04,78.16) v1(91.82,96.19) v1(91.82,1.45) v1(91.95,6.4) v1(92.08,95.3) v1(92.08,91.75) v1(92.08,9.07) v1(92.33,78.03) v1(92.33,76.63) v1(93.08,90.91) v1(93.22,92.89) v1(93.33,7.95) v1(94.74,89.84) v1(94.74,87.21) v1(94.82,23.52) v1(94.91,24.14) v1(95.38,85.14) v1(95.38,83.29) v1(96.08,14.64) v1(96.1,7.95) v1(96.45,72.84) v1(96.54,68.94) v1(96.54,13.15) v1(97.03,88.19) v1(97.16,66.72) v1(97.66,86.28) v1(97.69,70.62) v1(97.79,85.01) v1(97.79,83.21) v1(97.92,13.15) v1(98.3,18) v1(98.48,19.58) v1(99.02,72.75) v2(48.51,46.66) v2(48.51,45.88) v2(48.51,44.78)
VCC3V: length 282.7
  Top Layer w0.254: 14.35,69.14 15.28,70.07 677.6 ; 14.35,69.14 11.95,69.14 100nf#2.1 ; 14.35,69.14 16.13,69.14 17.78,70.79 677.11 ; 677.100 5.73,73.49 5.71,73.47 ; 11.95,91.36 12.78,90.53 677.75 ; 11.95,91.36 v1(13.21,91.36) ; 11.95,91.36 100nf#5.1 7.25,91.38 5.71,89.84 v1(5.71,78.28) ; 677.50 29.19,85.49 100NF#4.1 30.24,90.2 v1(29.08,91.36) ; 5.71,73.47 100nf#4.1 ; 5.71,73.47 v1(5.71,74.85) ; 100nf#3.1 25.51,66.87 21.78,70.6 677.19 ; v1(64.14,81.33) 64.15,81.35 10k#2.2 100nf#6.1 90.2,81.35 CN4.1 ; v1(55.88,76.38) 31.11,76.38 30.24,75.51 100nf.2 30.22,74.49 677.28
  Top Layer w0.508: U5.4 22.68,45.66 v3(6.32,45.66) NOREF#2.1
  Top Layer w1.016: 23.79,46.16 U5.4 ; 23.79,46.16 U5.2 ; 23.79,46.16 23.15,46.8 100NF#2.2 NOREF.2 23.15,57.74 ; 8.79,69.19 11.87,69.19 100nf#2.1 ; 8.79,69.19 8.79,59.48 10.53,57.74 23.15,57.74 ; 8.79,69.19 5.7,72.28 100nf#4.1 ; 100nf#3.1 26.42,66.83 26.42,61.01 23.15,57.74
  Bottom Layer w0.254: v1(5.71,78.28) v1(5.71,74.85) ; v1(55.88,76.38) 57.66,76.38 62.61,81.33 v1(64.14,81.33) ; v1(29.08,91.36) v1(13.21,91.36)
  Bottom Layer w0.508: 100NF#10.2 7,5.88 2.29,10.59 2.29,41.63 v3(6.32,45.66)
  Bottom Layer w1.27: 3V3#2.2 3V3#2.1 10.56,2.74 100NF#10.2
  vias: v1(28.07,65.58) v1(28.07,64.69) v1(29.1,64.69) v1(29.21,65.58) v1(29.61,72.21) v1(29.61,71.21) v1(30.7,72.21) v1(30.7,71.21)
VCC5V: length 283.8
  Top Layer w0.508: v3(4.19,38.41) 4.19,40.96 5K.1 29.7,41.09 30.86,39.93 33UH.2
  Top Layer w1.016: PE0.3 92.46,58.09 90.53,60.01 CN15.1 90.32,65.85 100NF#3.2 83.84,65.85 ; 72.26,37.52 72.26,32.45 100nf14.1 TB2.2 ; 72.26,37.52 TB2.13 60.14,37.39 C39.1 ; 72.26,37.52 72.26,62.66 75.45,65.85 83.84,65.85 ; C39.1 43.94,38.42 ; C39.1 43.94,37.14 ; 2.4 29.98,35.53 30.86,36.41 33UH.2 31.43,38.42 100nf8.2 43.94,38.42 ; 43.94,38.42 43.94,45.77 41.27,48.44 29.15,48.44 U5.3 ; 83.84,65.85 83.96,65.98
  Bottom Layer w0.508: 5V#2.1 20.83,2.76 20.83,7.29 19.18,8.94 7.75,8.94 4.19,12.5 v3(4.19,38.41)
  Bottom Layer w1.016: 100NF#3.2 90.22,65.85 CN18.4 93.15,65.64 94.23,66.73 94.23,79.93 93.22,80.95 90.17,80.95 ; CN17.4 90.22,81.22 100nf#7.1 ; 100nf22.2 92.47,58.09 PE0.3 97.92,55.8 97.92,44.5 95.76,42.34 P1.3 92.47,42.22 100nf15.1
  Bottom Layer w1.27: 5V#2.2 5V#2.1 20.87,5.87 100NF#11.2
  vias: v1(86.61,64.15) v1(86.61,63.2) v1(87.46,64.15) v1(87.46,63.2) v1(88.31,64.15) v1(88.31,63.2) v1(89.16,64.15) v1(89.16,63.2) v1(91.68,64.19) v1(91.68,63.24) v1(91.69,62.25) v1(91.69,61.3) v1(92.53,64.19) v1(92.53,63.24) v1(92.54,62.24) v1(92.54,61.3) v1(93.38,64.19) v1(93.38,63.24) v1(93.39,62.24) v1(93.39,61.3) v1(94.23,64.19) v1(94.23,63.24) v1(94.24,62.24) v1(94.24,61.3)
VCC7.4V: length 69.1
  Top Layer w0.508: 5K#2.2 29.84,24.44 28.69,25.59 2K1.1
  Top Layer w1.143: 36.56,22.02 100NF#8.2 ; 36.56,22.02 38.18,22.02 41.74,18.46 43.94,18.46 43.94,4.23 44.07,4.1 ; 36.56,22.02 34.24,22.02 ; 34.24,22.02 32.02,22.02 100NF#7.2 31.88,22.17 5K#2.2 ; 34.24,22.02 33UH#2.2
VCC12V: length 88.6
  Top Layer w1.27: v4(40.26,27.23) 33.15,27.23 FU1.1 ; v4(40.26,16.31) 40.26,10.61 100NF#6.2 40.24,8.17 FU2.1 40.2,6.76 12V.2 12V.1 ; TB2.1 100nf13.1 72.26,29.88 72.26,21.13 70.99,19.86 61.85,19.86 60.32,18.34 C38.1 v4(57.02,16.31)
  Bottom Layer w1.27: v4(57.02,16.31) v4(40.26,16.31) v4(40.26,27.23) ; 12V.1 31.15,5.87 100NF1.2
AIN1: length 77
  Top Layer w0.254: v1(53.59,40.95) v1(53.59,54.66) ; 677.39 53.16,79.99 v1(53.59,79.55)
  Bottom Layer w0.254: TB2.14 56.52,34.98 55.24,36.25 55.24,39.29 v1(53.59,40.95) ; v1(53.59,54.66) v1(53.59,79.55)
AIN2: length 80.5
  Top Layer w0.254: 677.40 v1(54.36,80.49) ; v1(54.36,38.91) v1(54.36,53.52)
  Bottom Layer w0.254: v1(54.36,80.49) v1(54.36,53.52) ; TB2.15 56.9,32.44 54.36,34.98 v1(54.36,38.91)
AO1: length 39
  Top Layer w1.27: TB2.4 78.36,37.52 79.88,35.99 79.88,26.09 94.97,11 97.52,11 U10.1
AO2: length 38
  Top Layer w1.27: TB2.5 80.01,40.06 82.93,37.14 82.93,27.23 94.15,16.01 U10.2
BIN1: length 91.7
  Top Layer w0.254: TB2.12 57.15,40.06 55.63,41.58 v1(55.63,52.63) ; 677.71 v1(14.78,88.44)
  Bottom Layer w0.254: v1(55.63,52.63) 55.12,53.14 55.12,84.38 51.05,88.44 v1(14.78,88.44)
BIN2: length 97.5
  Top Layer w0.254: 677.77 7.01,84.99 v1(6.98,85.01)
  Bottom Layer w0.254: v1(6.98,85.01) 6.98,51.11 9.65,48.44 56.77,48.44 57.66,47.55 57.66,43.23 58.29,42.6 TB2.11
BO1: length 35.2
  Top Layer w1.27: U11.2 93.51,26.17 88.52,31.17 88.52,39.93 83.31,45.14 TB2.7
BO2: length 36.5
  Top Layer w1.27: TB2.6 81.53,42.6 85.73,38.41 85.73,29.13 93.69,21.17 U11.1
LED2_PC4: length 62.7
  Top Layer w0.254: 2K#2.1 71.77,95.68 57.15,95.68 56.13,94.67 56.13,78.41 54.71,76.99 677.33
LED3_PC5: length 65.1
  Top Layer w0.254: 677.34 54.33,77.49 55.5,78.66 55.5,97.46 56.46,98.42 2K.1
OSC_IN: length 11.8
  Top Layer w0.254: 1M.1 17.53,63.92 22PF#2.2 16.49,64.91 X1.1 16.49,68.61 17.02,69.14 17.91,69.14 18.28,69.52 677.12
OSC_OUT: length 11.7
  Top Layer w0.254: 677.13 18.78,69.53 19.18,69.14 20.07,69.14 20.59,68.61 X1.2 20.59,64.91 21.57,63.93 ; 1M.2 21.57,63.93 ; 21.57,63.93 22PF.2
PC6: length 27.4
  Top Layer w0.254: 677.63 18.78,92.24 20.19,93.65 36.58,93.65 37.69,92.53 电机A1.6
PC7: length 31
  Top Layer w0.254: 677.64 18.28,92.63 19.81,94.16 38.61,94.16 40.13,92.63 40.13,90.39 电机A1.5
PC8: length 34.8
  Top Layer w0.254: 677.65 17.78,93.02 19.43,94.67 40.77,94.67 42.67,92.76 42.67,90.35 电机A1.4
PC9: length 38.6
  Top Layer w0.254: 677.66 17.28,93.41 19.05,95.17 43.05,95.17 45.21,93.02 45.21,90.35 电机A1.3
PE0: length 112.8
  Top Layer w0.254: v1(9.27,75.62) 9.9,74.99 677.97
  Bottom Layer w0.254: v1(9.27,75.62) 9.27,53.9 11.94,51.23 78.36,51.23 81.66,47.93 PE0.1
PE1: length 129.7
  Top Layer w0.254: 677.98 v1(8.13,74.49)
  Bottom Layer w0.254: v1(8.13,74.49) 8.13,52.63 10.8,49.96 76.58,49.96 78.23,48.31 78.23,33.71 79.88,32.06 v1(95.76,32.06)
PWMA: length 113
  Top Layer w0.254: v1(63.12,90.09) v1(63.12,40.06) ; v1(16,90.09) 16.78,89.31 677.67
  Bottom Layer w0.254: v1(63.12,90.09) v1(16,90.09) ; TB2.16 62.23,29.9 63.12,30.78 v1(63.12,40.06)
PWMB: length 92.9
  Top Layer w0.254: v1(61.85,89.2) 61.85,46.72 TB2.10 ; v1(16,89.2) 16.28,88.92 677.68
  Bottom Layer w0.254: v1(61.85,89.2) v1(16,89.2)
RESET: length 104.2
  Top Layer w0.254: v1(32.89,63.55) 32.89,64.81 10K.2 55.31,64.82 56.77,66.28 56.77,92.38 58.04,93.65 84.12,93.65 复位.1 ; 677.14 19.28,70.56 19.69,70.16 v1(20.7,70.16)
  Bottom Layer w0.254: 复位.1 复位.2 ; v1(32.89,63.55) 27.3,63.55 v1(20.7,70.16)
STEER1: length 108.4
  Top Layer w0.254: v1(49.15,52.38) v1(49.15,39.04) ; v1(21.59,78.03) 20.78,78.84 677.59 ; v1(49.15,17.83) 49.15,11.99 GND.1
  Bottom Layer w0.254: v1(49.15,52.38) 49.15,74.47 45.59,78.03 v1(21.59,78.03) ; v1(49.15,39.04) v1(49.15,17.83)
STEER2: length 107.6
  Top Layer w0.254: v1(20.95,77.27) 20.28,77.94 677.60 ; GND.4 47.88,10.72 v1(47.88,17.83) ; v1(47.88,39.04) v1(47.88,52.38)
  Bottom Layer w0.254: v1(47.88,52.38) 47.88,74.47 45.08,77.27 v1(20.95,77.27) ; v1(47.88,17.83) v1(47.88,39.04)
STEER3: length 106.9
  Top Layer w0.254: v1(46.61,52.38) v1(46.61,39.04) ; v1(46.61,17.83) 46.61,9.45 GND.7 ; 677.61 19.78,76.79 v1(20.19,76.38)
  Bottom Layer w0.254: v1(20.19,76.38) 44.58,76.38 46.61,74.35 v1(46.61,52.38) ; v1(46.61,39.04) v1(46.61,17.83)
STEER4: length 106.4
  Top Layer w0.254: 677.62 v1(19.28,75.62) ; GND.10 45.47,8.05 v1(45.47,17.83) ; v1(45.47,52.38) v1(45.47,39.04)
  Bottom Layer w0.254: v1(45.47,39.04) v1(45.47,17.83) ; v1(45.47,52.38) 45.47,74.35 44.2,75.62 v1(19.28,75.62)
SWCLK: length 86.5
  Top Layer w0.254: v1(82.55,88.19) 90.21,88.19 CN4.4 ; 677.76 12.98,85.49 v1(13.72,84.76) ; v1(53.47,88.19) v1(53.47,82.47) 53.47,82.35
  Bottom Layer w0.254: v1(13.72,84.76) 51.18,84.76 v1(53.47,82.47) ; v1(82.55,88.19) v1(53.47,88.19)
SWDIO: length 86.6
  Top Layer w0.254: v1(54.36,86.54) v1(54.36,83.11) ; v1(82.04,83.36) 83.93,83.36 ; 83.93,83.36 83.93,85.38 84.56,86.01 CN4.3 ; 83.93,83.36 10k#2.1 ; 677.72 v1(14.28,85.78)
  Bottom Layer w0.254: v1(54.36,86.54) 80.52,86.54 82.04,85.01 v1(82.04,83.36) ; v1(54.36,83.11) 51.69,85.78 v1(14.28,85.78)
USART1_RX: length 82.7
  Top Layer w0.254: v1(43.05,69.77) v1(55.88,69.77) ; 677.93 14.88,76.99 v1(17.78,74.09) ; v1(84.45,70.66) 84.48,70.64 CN15.3
  Bottom Layer w0.254: v1(43.05,69.77) 38.73,74.09 v1(17.78,74.09) ; v1(55.88,69.77) 83.57,69.77 v1(84.45,70.66)
USART1_TX: length 81.6
  Top Layer w0.254: 677.92 15.65,77.49 v1(18.29,74.85) ; CN15.4 87.19,73.14 v1(86.61,72.57) ; v1(43.05,72.57) v1(55.88,72.57)
  Bottom Layer w0.254: v1(18.29,74.85) 40.77,74.85 v1(43.05,72.57) ; v1(86.61,72.57) v1(55.88,72.57)
USART2_RX: length 91.4
  Top Layer w0.254: 677.87 17.85,79.99 v1(18.54,79.3) ; v1(55.88,67.36) v1(51.82,67.36)
  Bottom Layer w0.254: v1(55.88,67.36) 83.06,67.36 86.34,70.64 CN18.2 ; v1(18.54,79.3) 49.4,79.3 51.82,76.89 v1(51.82,67.36)
USART2_TX: length 84.5
  Top Layer w0.254: 677.86 v1(18.54,80.49) ; v1(55.88,75.23) v1(52.58,75.23)
  Bottom Layer w0.254: CN18.1 88.34,75.23 v1(55.88,75.23) ; v1(18.54,80.49) 51.26,80.49 52.58,79.17 v1(52.58,75.23)
USART3_RX: length 81.7
  Top Layer w0.254: v1(51.69,92.51) 51.69,88.19 51.18,87.68 35.56,87.68 30.35,92.89 23.37,92.89 22.28,91.8 677.56
  Bottom Layer w0.254: CN17.1 90.37,88.57 86.61,88.57 82.68,92.51 v1(51.69,92.51)
USART3_TX: length 80.4
  Top Layer w0.254: v1(52.58,91.24) 52.58,87.81 51.56,86.79 35.31,86.79 29.84,92.25 24,92.25 22.78,91.03 677.55
  Bottom Layer w0.254: v1(52.58,91.24) 82.55,91.24 87.76,86.03 90.41,86.03 CN17.2
$1N4303: length 2.6
  Top Layer w0.254: 5K.2 4.01,43.14 1.52,43.14
$1N4305: length 2.5
  Top Layer w0.254: 1.57,47.66 NOREF#2.2
$1N4501: length 2.5
  Top Layer w0.254: PC5.2 76.24,98.42 2K.2
$1N4502: length 2.5
  Top Layer w0.254: 2K#2.2 76.29,95.67 76.29,95.68
$1N4552: length 14.1
  Top Layer w0.254: 100NF#5.2 10UF.2 2.2UF.2 0.2 28.7,70.16 28.45,70.41 23.62,70.41 23.28,70.75 677.22
$1N4554: length 4.6
  Top Layer w0.254: 677.73 13.78,89.02 14.48,89.71 2.2u#2.2
$1N4555: length 4.4
  Top Layer w0.254: 2.2u.2 29.08,83.87 27.96,84.99 677.49
$1N11019: length 5.5
  Top Layer w0.254: 677.94 5.71,76.49 10K#2.1
$1N28449: length 8.5
  Top Layer w1.27: 2.1 23.55,28.57 24.83,27.3 FU1.2
$1N28458: length 14.4
  Top Layer w1.016: SS34.1 37.35,31.59 33UH.1 30.32,32.13 2.2
$1N28460: length 19.4
  Top Layer w1.27: 5.1 23.62,15.05 23.62,9.32 24.83,8.12 FU2.2
$1N28462: length 8.4
  Top Layer w1.143: 5.4 31.88,20.17 100NF#7.1
$1N28463: length 9.6
  Top Layer w1.143: 33UH#2.1 27.87,11.6 ss34.1 27.82,16.77 5.2
$1N28554: length 2.6
  Top Layer w0.254: 2K1.2 4.01,27.64 1.52,27.64

## Copper pours and planes (outline as drawn; the poured copper is in the pictures)
GND on Top Layer: -22.48,123.24 103.63,123.24 103.63,-3.12 -22.48,-3.12
GND on Bottom Layer: -7.11,106.1 121.16,106.1 121.16,-14.94 -7.11,-14.94
VCC3V on Top Layer: 29.13,75.37 31.13,75.37 31.13,70.73 29.13,70.73
VCC3V on Top Layer: 25.53,68.21 31.63,68.21 31.63,63.56 25.53,63.56
VCC3V on Bottom Layer: 27.21,72.95 32,72.95 32,64.19 27.21,64.19
VCC5V on Top Layer: 85.22,66.64 97.15,66.64 97.15,56.08 85.22,56.08
VCC5V on Bottom Layer: 88.39,66.6 94.88,66.6 94.88,65.85 88.39,65.85
VCC5V on Bottom Layer: 85.22,66.64 97.15,66.64 97.15,56.08 85.22,56.08
VCC7.4V on Top Layer: 42.93,5.15 55.75,5.15 55.75,3.1 42.93,3.1
VCC12V on Top Layer: 58.29,17.7 62.23,17.7 62.23,8.94 58.29,8.94
POWER12V on Bottom Layer: 63.75,18.06 67.18,18.06 67.18,8.81 63.75,8.81
$1N4552 on Top Layer: 22.62,72.78 23.45,72.78 23.45,71.1 22.62,71.1
$1N28449 on Top Layer: 20.88,31.18 26.22,31.18 26.22,29.27 20.88,29.27
$1N28460 on Top Layer: 20.95,15.8 26.29,15.8 26.29,13.89 20.95,13.89
$1N28468 on Bottom Layer: 68.31,18.72 78.61,18.72 78.61,14.02 68.31,14.02

Small or netless copper shapes (teardrops, artwork), in the pictures only: 275 on Top Layer, 111 on Bottom Layer

## Text on the board
Top Silkscreen Layer: PC6 | PC7 | PC8 | PC9 | GND | 5V | 100NF | D15 | D14 | D13 | D12 | 7.4 | 680UF | PE1 | AO1 | BO2 | AO2 | BO1 | 2_TX | 3_TX | 2_RX | 3_RX | VCC | SWCLK | SWDIO | 1_TX | 1_RX | 220UF | 反 | 正 | 开 | 关
